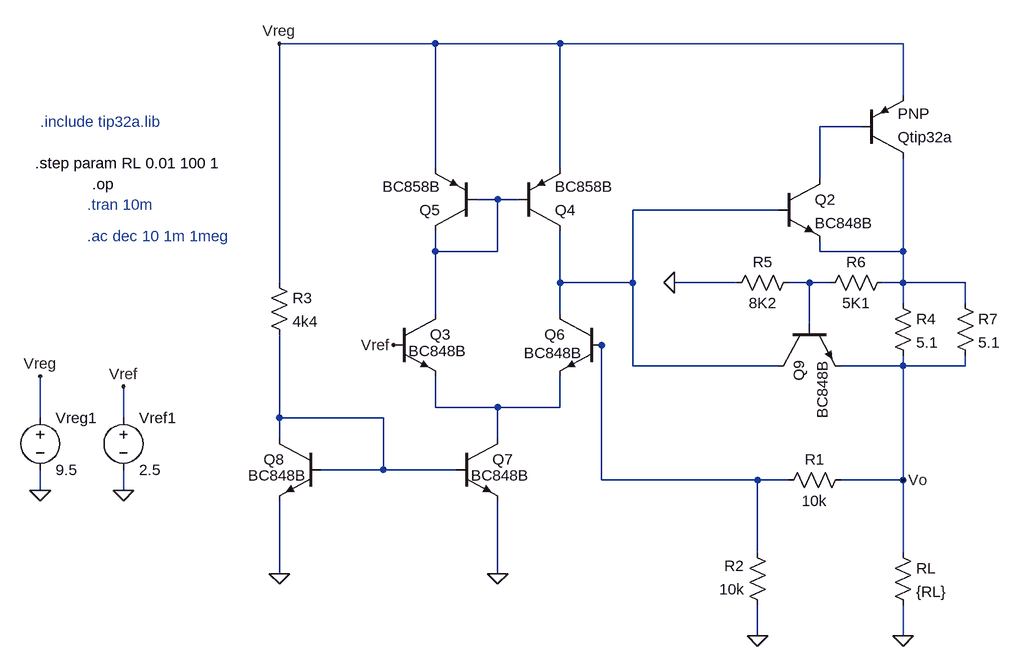
[diagram p0: schematic Regulador_con_Foldback.asc]
Regulador_con_Foldback.asc, the LTspice schematic file:
Version 4
SHEET 1 1512 816
WIRE 192 -192 -48 -192
WIRE 384 -192 192 -192
WIRE 912 -192 384 -192
WIRE 912 -112 912 -192
WIRE 848 -64 784 -64
WIRE 192 0 192 -192
WIRE 384 0 384 -192
WIRE 784 16 784 -64
WIRE 288 48 256 48
WIRE 320 48 288 48
WIRE 720 64 496 64
WIRE 192 128 192 96
WIRE 288 128 288 48
WIRE 288 128 192 128
WIRE 784 128 784 112
WIRE 912 128 912 -16
WIRE 912 128 784 128
WIRE -48 176 -48 -192
WIRE 384 176 384 96
WIRE 496 176 496 64
WIRE 496 176 384 176
WIRE 656 176 560 176
WIRE 768 176 736 176
WIRE 800 176 768 176
WIRE 912 176 912 128
WIRE 912 176 880 176
WIRE 1008 176 912 176
WIRE 912 208 912 176
WIRE 1008 208 1008 176
WIRE 192 224 192 128
WIRE 384 224 384 176
WIRE 768 240 768 176
WIRE 448 272 432 272
WIRE 496 304 496 176
WIRE 720 304 496 304
WIRE 912 304 912 288
WIRE 912 304 816 304
WIRE 1008 304 1008 288
WIRE 1008 304 912 304
WIRE 192 368 192 320
WIRE 288 368 192 368
WIRE 384 368 384 320
WIRE 384 368 288 368
WIRE -416 384 -416 320
WIRE -288 384 -288 336
WIRE -48 384 -48 256
WIRE 112 384 -48 384
WIRE -48 416 -48 384
WIRE 288 416 288 368
WIRE 112 464 112 384
WIRE 112 464 16 464
WIRE 224 464 112 464
WIRE 448 480 448 272
WIRE 688 480 448 480
WIRE 736 480 688 480
WIRE 912 480 912 304
WIRE 912 480 816 480
WIRE -416 496 -416 464
WIRE -288 496 -288 464
WIRE 688 592 688 480
WIRE 912 592 912 480
WIRE -48 624 -48 512
WIRE 288 624 288 512
WIRE 688 720 688 672
WIRE 912 720 912 672
FLAG 288 624 0
FLAG -48 624 0
FLAG 912 720 0
FLAG 688 720 0
FLAG -288 496 0
FLAG 128 272 Vref
FLAG -288 336 Vref
FLAG -416 496 0
FLAG -416 320 Vreg
FLAG -48 -192 Vreg
FLAG 912 480 Vo
FLAG 560 176 0
SYMBOL npn 720 16 R0
SYMATTR InstName Q2
SYMATTR Value BC848B
SYMBOL npn 128 224 R0
WINDOW 3 23 57 Left 2
SYMATTR Value BC848B
SYMATTR InstName Q3
SYMBOL pnp 320 96 M180
SYMATTR InstName Q4
SYMATTR Value BC858B
SYMBOL pnp 256 96 R180
SYMATTR InstName Q5
SYMATTR Value BC858B
SYMBOL npn 448 224 M0
WINDOW 3 30 60 Left 2
SYMATTR Value BC848B
SYMATTR InstName Q6
SYMBOL npn 224 416 R0
WINDOW 3 23 57 Left 2
SYMATTR Value BC848B
SYMATTR InstName Q7
SYMBOL npn 16 416 M0
WINDOW 3 23 57 Left 2
SYMATTR Value BC848B
SYMATTR InstName Q8
SYMBOL res 832 464 R90
WINDOW 0 0 56 VBottom 2
WINDOW 3 32 56 VTop 2
SYMATTR InstName R1
SYMATTR Value 10k
SYMBOL res 704 688 R180
WINDOW 0 36 76 Left 2
WINDOW 3 36 40 Left 2
SYMATTR InstName R2
SYMATTR Value 10k
SYMBOL res -64 160 R0
SYMATTR InstName R3
SYMATTR Value 4k4
SYMBOL voltage -288 368 R0
WINDOW 123 0 0 Left 0
WINDOW 39 0 0 Left 0
SYMATTR InstName Vref1
SYMATTR Value 2.5
SYMBOL voltage -416 368 R0
WINDOW 123 0 0 Left 0
WINDOW 39 0 0 Left 0
SYMATTR InstName Vreg1
SYMATTR Value 9.5
SYMBOL npn 720 240 M90
SYMATTR InstName Q9
SYMATTR Value BC848B
SYMBOL res 896 192 R0
SYMATTR InstName R4
SYMATTR Value 5.1
SYMBOL res 752 160 R90
WINDOW 0 0 56 VBottom 2
WINDOW 3 32 56 VTop 2
SYMATTR InstName R5
SYMATTR Value 8K2
SYMBOL res 896 160 R90
WINDOW 0 0 56 VBottom 2
WINDOW 3 32 56 VTop 2
SYMATTR InstName R6
SYMATTR Value 5K1
SYMBOL res 896 576 R0
SYMATTR InstName RL
SYMATTR Value {RL}
SYMBOL pnp 848 -16 M180
SYMATTR InstName Qtip32a
SYMBOL res 992 192 R0
SYMATTR InstName R7
SYMATTR Value 5.1
TEXT -336 24 Left 2 !.op
TEXT -344 56 Left 2 ;.tran 10m
TEXT -344 104 Left 2 ;.ac dec 10 1m 1meg
TEXT -424 -8 Left 2 !.step param RL 0.01 100 1
TEXT -416 -72 Left 2 ;.include tip32a.lib

The netlist it stands for:
* Regulador_con_Foldback.asc
Q2 N001 N003 N004 0 BC848B
Q3 N002 Vref N007 0 BC848B
Q4 N003 N002 Vreg 0 BC858B
Q5 N002 N002 Vreg 0 BC858B
Q6 N003 N006 N007 0 BC848B
Q7 N007 N008 0 0 BC848B
Q8 N008 N008 0 0 BC848B
R1 Vo N006 10k
R2 0 N006 10k
R3 Vreg N008 4k4
Vref1 Vref 0 2.5
Vreg1 Vreg 0 9.5
Q9 N003 N005 Vo 0 BC848B
R4 N004 Vo 5.1
R5 N005 0 8K2
R6 N004 N005 5K1
RL Vo 0 {RL}
Qtip32a N004 N001 Vreg 0 PNP
R7 N004 Vo 5.1
.model NPN NPN
.model PNP PNP
.lib standard.bjt
.op
* .tran 10m
* .ac dec 10 1m 1meg
.step param RL 0.01 100 1
* .include tip32a.lib
.backanno
.end